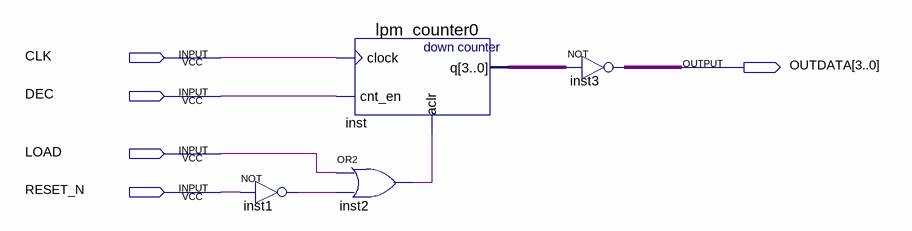
[diagram p0: schematic sheet]
// Quartus schematic dcnt4.bdf as structural Verilog: 4 symbols, 5 pins
module dcnt4 (
  input  CLK,
  input  DEC,
  input  LOAD,
  input  RESET_N,
  output [3:0] OUTDATA
);

  wire inst1_out, inst2_out;
  wire [3:0] inst_q;

  not inst1 (inst1_out, RESET_N);
  lpm_counter0 inst (.clock(CLK), .cnt_en(DEC), .aclr(inst2_out), .q(inst_q));
  or inst2 (inst2_out, LOAD, inst1_out);
  assign OUTDATA = ~inst_q;  // NOT inst3, 4 bits wide
endmodule
